# EasyEDA Pro project PCB_主控有光耦2.0.epro

# Board PCB_PCB_主控有光耦2.0_2025-02-19_1
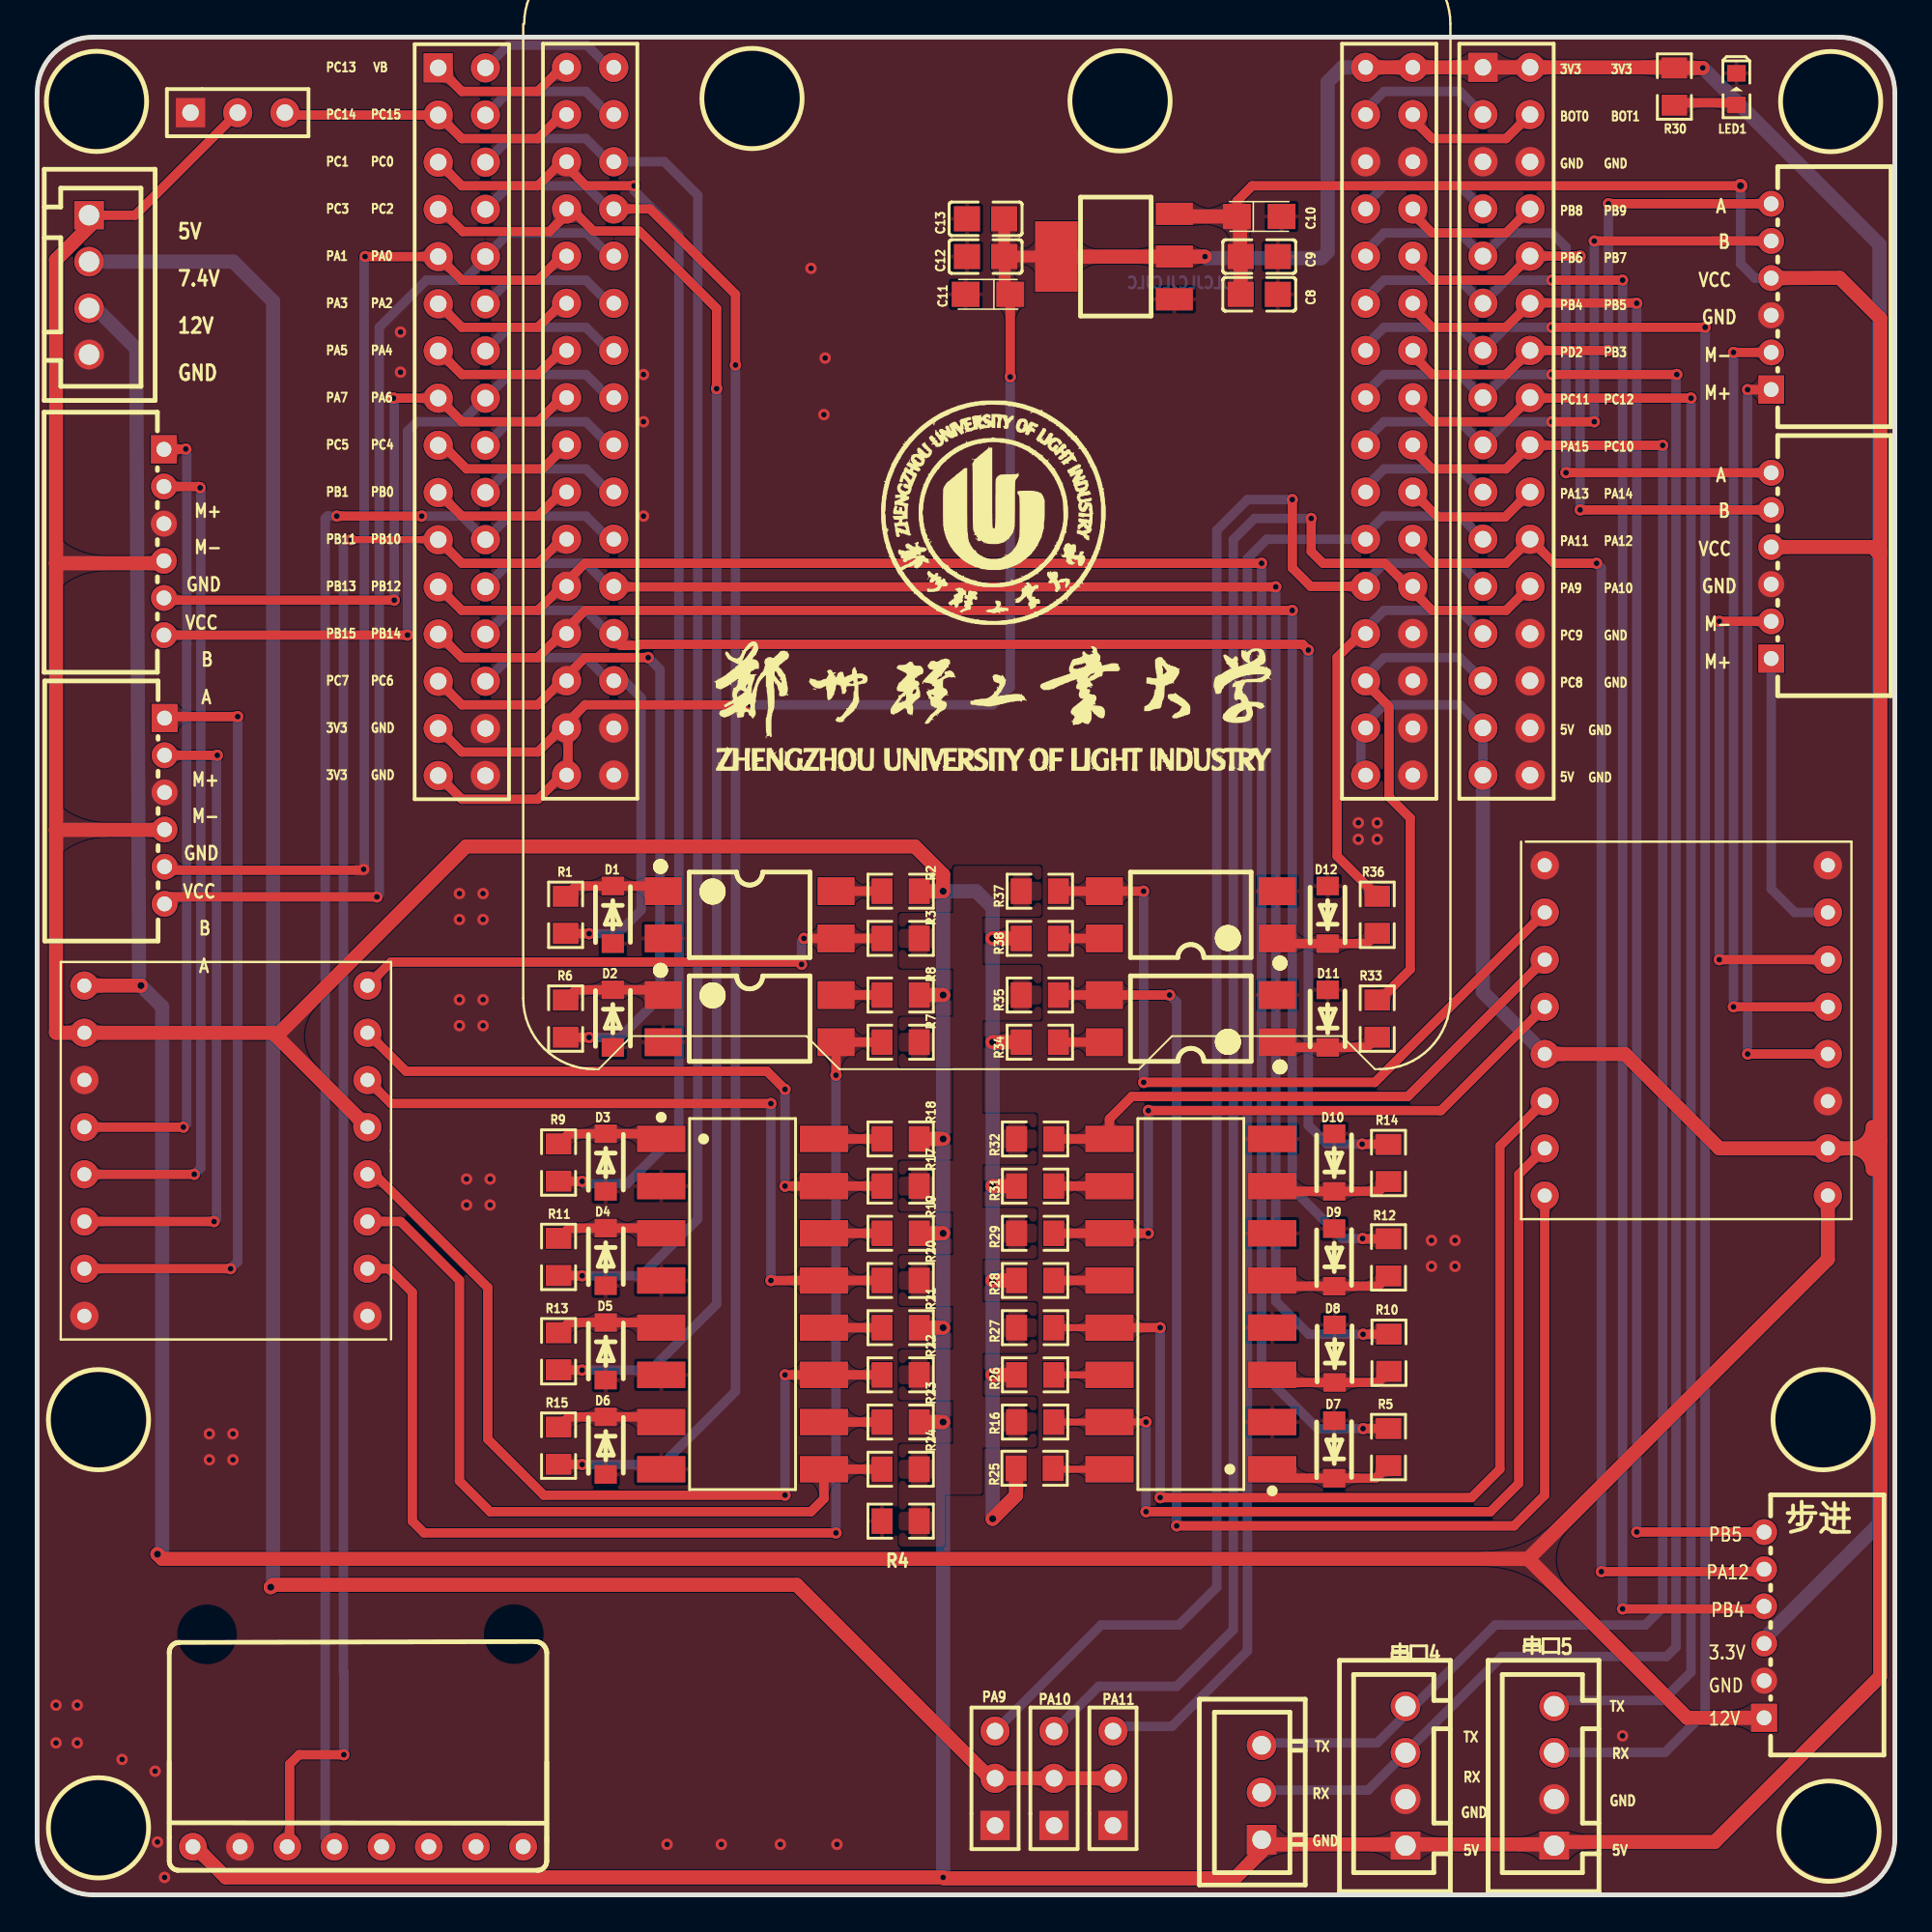
[diagram p0: board, top side]
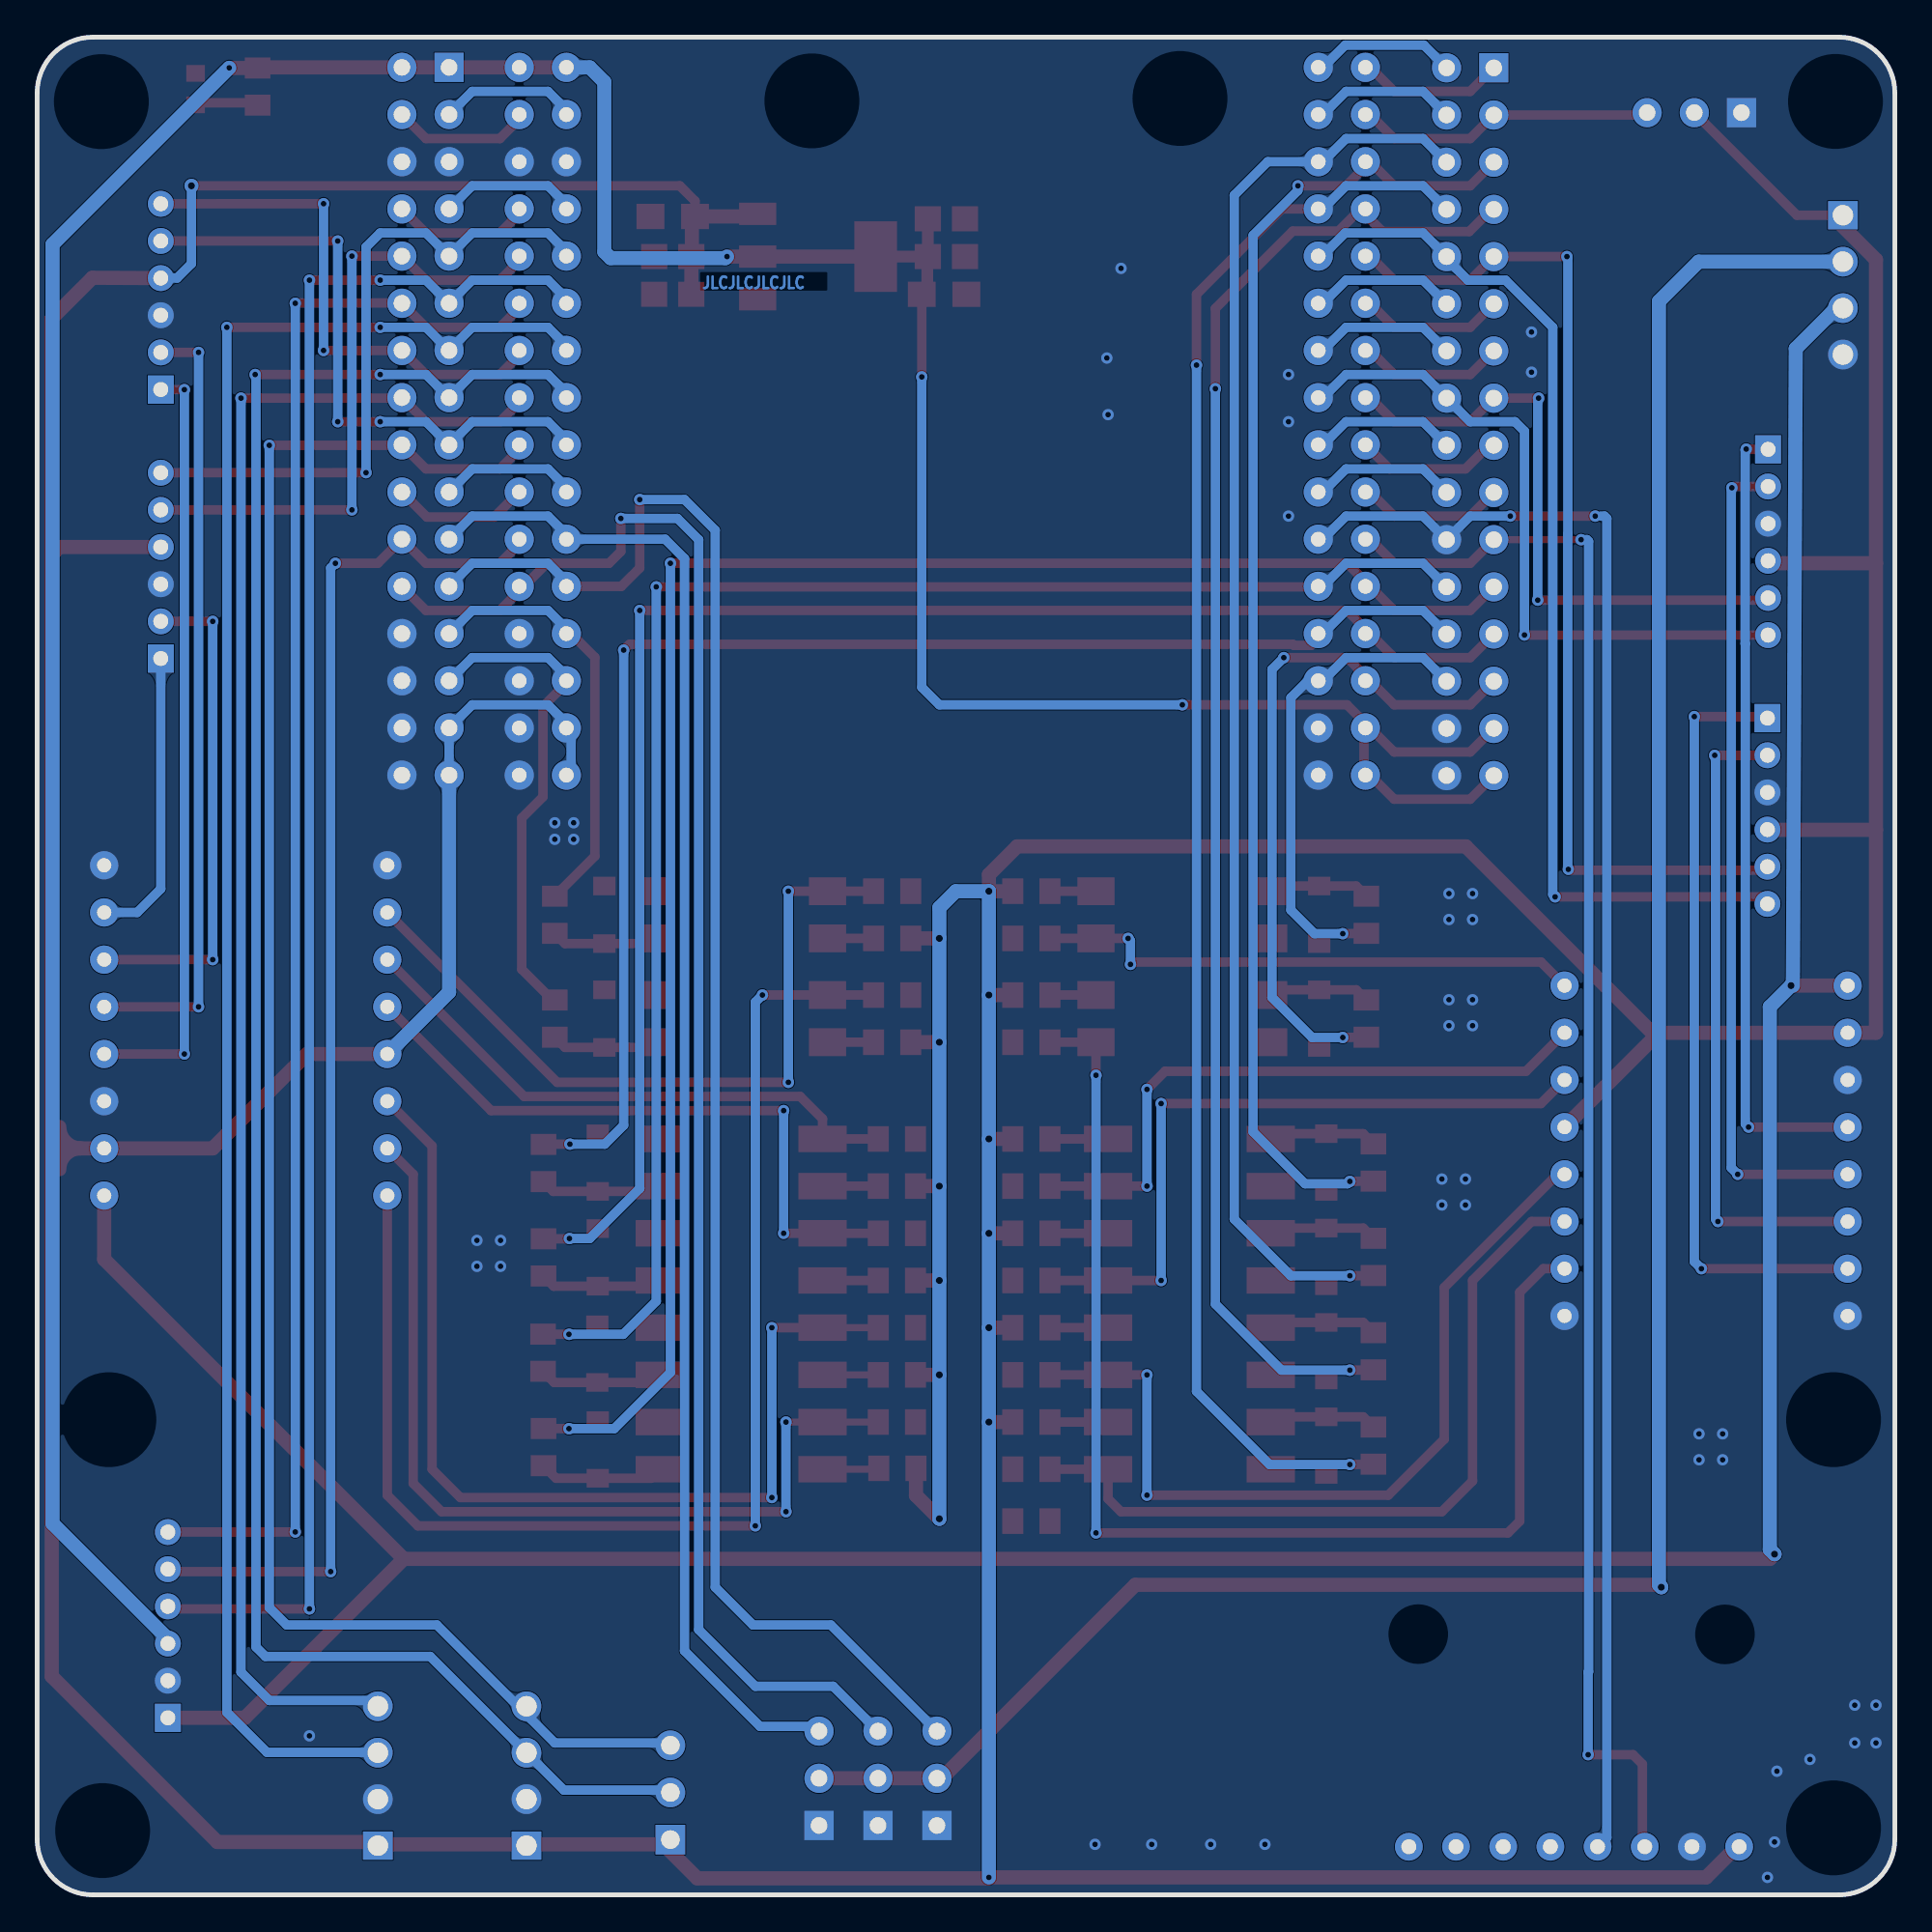
[diagram p1: board, bottom side, seen from below]

Outline 100 x 100 mm; copper layers: Top Layer, Bottom Layer. Coordinates in mm from the lower left corner of the outline.
Outline path: 0,97 arc(0.88,99.12) 3,100 97,100 arc(99.12,99.12) 100,97 100,3 arc(99.12,0.88) 97,0 3,0 arc(0.88,0.88) 0,3 0,97
Stack: Top Layer 0.035mm / Dielectric1 1.51mm FR4 er 4.5 / Bottom Layer 0.035mm

## Design rules (mm)
spacing Default (default): track to track 0.152, other pairs 0 to 0.152
track width Default (default): min 0.254, default 0.254, max 25.4
differential pair differentialPair (default): width min 0.127, default 0.254, max 2.54; gap min 0.152, default 0.152
via Default (default): diameter min 0.61, default 0.61, max 100.025; hole min 0.305, default 0.305, max 59.995
pour e923 uses gge64914

## Placement (name value [footprint] x y rotation side)
C8  0.1u  [C0805]  65.79 86.16 180 top
C9  10u  [C0805]  65.79 88.19 180 top
C10  0.1u  [CASE-A_3216]  65.79 90.35 0 top
C11  0.1u  [CASE-A_3216]  51.18 86.16 180 top
C12  10u  [C0805]  51.05 88.19 0 top
C13  0.1u  [C0805]  51.05 90.22 0 top
CN1  KH-PH-6P-W  [CONN-TH_6P-P2.00_KINGHELM_KH-PH-6P-W]  6.82 72.81 270 top
CN2  KH-PH-6P-W  [CONN-TH_6P-P2.00_KINGHELM_KH-PH-6P-W]  6.86 58.34 270 top
CN3  KH-PH-6P-W  [CONN-TH_6P-P2.00_KINGHELM_KH-PH-6P-W]  93.34 86.03 90 top
CN4  KH-PH-6P-W  [CONN-TH_6P-P2.00_KINGHELM_KH-PH-6P-W]  93.34 71.55 90 top
CN7  KH-PH-6P-W  [CONN-TH_6P-P2.00_KINGHELM_KH-PH-6P-W]  92.96 14.53 90 top
CN10  -  [CONN-TH_4P-P2.50_4PIN]  81.66 6.4 90 top
CN10#2  -  [CONN-TH_4P-P2.50_4PIN]  2.79 86.67 270 top
CN11  ZX-XH2.54-4PZZ  [CONN-TH_4P-P2.50_4PIN]  73.66 6.4 90 top
CN12  ZX-XH2.54-3PZZ  [CONN-TH_3P-P2.54_2501S-3P]  65.91 5.51 90 top
D1  1N4001W  [SOD-123F_L2.8-W1.8-LS3.7-RD]  30.99 52.76 270 top
D2  1N4001W  [SOD-123F_L2.8-W1.8-LS3.7-RD]  30.99 47.17 270 top
D3  1N4001W  [SOD-123F_L2.8-W1.8-LS3.7-RD]  30.61 39.42 270 top
D4  1N4001W  [SOD-123F_L2.8-W1.8-LS3.7-RD]  30.61 34.34 270 top
D5  1N4001W  [SOD-123F_L2.8-W1.8-LS3.7-RD]  30.61 29.26 270 top
D6  1N4001W  [SOD-123F_L2.8-W1.8-LS3.7-RD]  30.61 24.18 270 top
D7  1N4001W  [SOD-123F_L2.8-W1.8-LS3.7-RD]  69.82 23.98 90 top
D8  1N4001W  [SOD-123F_L2.8-W1.8-LS3.7-RD]  69.85 29.13 90 top
D9  1N4001W  [SOD-123F_L2.8-W1.8-LS3.7-RD]  69.82 34.31 90 top
D10  1N4001W  [SOD-123F_L2.8-W1.8-LS3.7-RD]  69.82 39.42 90 top
D11  1N4001W  [SOD-123F_L2.8-W1.8-LS3.7-RD]  69.47 47.17 90 top
D12  1N4001W  [SOD-123F_L2.8-W1.8-LS3.7-RD]  69.47 52.76 90 top
H1  HDR-F-2.54_2x16  [HDR-F-2.54_2X16]  22.86 79.3 270 top
H2  HDR-F-2.54_2x16  [HDR-F-2.54_2X16]  79.1 79.32 270 top
J2  HDR-M-2.54_1x3  [HDR-M-2.54_1X3]  51.56 6.27 90 top
J3  HDR-M-2.54_1x3  [HDR-M-2.54_1X3]  54.74 6.27 90 top
J4  -  [HDR-M-2.54_1X3]  10.8 95.94 0 top
J4#2  -  [HDR-M-2.54_1X3]  57.91 6.27 90 top
LED1  LED-0603_R  [LED0603_RED]  91.47 97.2 90 top
P1  -  [MPU6050模块]  17.53 5.89 270 top
R1  215Ω  [R0805]  28.45 52.76 90 top
R2  2k  [R0805]  46.48 54.03 0 top
R3  10k  [R0805]  46.48 51.49 0 top
R4  0  [R0805]  46.48 20.12 0 top
R5  215Ω  [R0805]  72.74 24.1 270 top
R6  215Ω  [R0805]  28.45 47.17 90 top
R7  10k  [R0805]  46.48 45.9 0 top
R8  2k  [R0805]  46.48 48.44 0 top
R9  215Ω  [R0805]  28.07 39.42 90 top
R10  215Ω  [R0805]  72.77 29.18 270 top
R11  215Ω  [R0805]  28.07 34.34 90 top
R12  215Ω  [R0805]  72.74 34.31 270 top
R13  215Ω  [R0805]  28.07 29.26 90 top
R14  215Ω  [R0805]  72.74 39.39 270 top
R15  215Ω  [R0805]  28.07 24.18 90 top
R16  10k  [R0805]  53.72 25.45 180 top
R17  10k  [R0805]  46.48 38.15 0 top
R18  2k  [R0805]  46.48 40.69 0 top
R19  2k  [R0805]  46.48 35.61 0 top
R20  10k  [R0805]  46.48 33.07 0 top
R21  2k  [R0805]  46.48 30.53 0 top
R22  10k  [R0805]  46.48 27.99 0 top
R23  2k  [R0805]  46.48 25.45 0 top
R24  10k  [R0805]  46.48 22.91 0 top
R25  2k  [R0805]  53.69 22.96 180 top
R26  2k  [R0805]  53.72 27.99 180 top
R27  10k  [R0805]  53.72 30.53 180 top
R28  2k  [R0805]  53.72 33.07 180 top
R29  10k  [R0805]  53.72 35.61 180 top
R30  1k  [R0805]  88.13 97.34 90 top
R31  2k  [R0805]  53.72 38.15 180 top
R32  10k  [R0805]  53.72 40.69 180 top
R33  215Ω  [R0805]  72.14 47.17 270 top
R34  2k  [R0805]  53.97 45.9 180 top
R35  10k  [R0805]  53.97 48.44 180 top
R36  215Ω  [R0805]  72.14 52.76 270 top
R37  10k  [R0805]  53.97 54.03 180 top
R38  2k  [R0805]  53.97 51.49 180 top
U1  NO  [STM32F103RCT6最小系统]  51.56 79.43 0 top
U2  -  [TB6612电机驱动]  10.16 40.06 0 top
U3  -  [TB6612电机驱动]  88.77 46.53 180 top
U4  AMS1117-3.3  [SOT-223]  58.04 88.19 180 top
U5  TLP521-1XSM  [SMD-4_L4.6-W6.5-P2.54-LS10.2-BL]  38.35 47.17 270 top
U7  TLP521-1XSM  [SMD-4_L4.6-W6.5-P2.54-LS10.2-BL]  38.35 52.76 270 top
U8  TLP521-4XSM  [SMD-16_L20.0-W6.5-P2.54-LS10.2-BL]  37.97 31.8 270 top
U9  TLP521-4XSM  [SMD-16_L20.0-W6.5-P2.54-LS10.2-BL]  62.1 31.8 90 top
U10  TLP521-1XSM  [SMD-4_L4.6-W6.5-P2.54-LS10.2-BL]  62.1 47.17 90 top
U11  TLP521-1XSM  [SMD-4_L4.6-W6.5-P2.54-LS10.2-BL]  62.1 52.76 90 top

## Footprints (pads in the part's own frame, mm; a bottom-side part is the same pattern mirrored in y, then rotated)
C0805
  rect 1.41x1.35 smd: 1(-1,0) 2(1,0)
CASE-A_3216
  rect 1.5x1.359 smd: 1(-1.2,0) 2(1.2,0)
CONN-TH_3P-P2.54_2501S-3P
  rect 1.6x1.6 hole 1: 1(-2.54,0)
  round 1.6 hole 1: 2(0,0) 3(2.54,0)
CONN-TH_4P-P2.50_4PIN
  rect 1.524x1.6 hole 1.1: 1(-3.75,0)
  round 1.6 hole 1.1: 2(-1.25,0) 3(1.25,0) 4(3.75,0)
CONN-TH_6P-P2.00_KINGHELM_KH-PH-6P-W
  rect 1.524x1.4 hole 0.8: 1(-5,0)
  round 1.4 hole 0.8: 2(-3,0) 3(-1,0) 4(1,0) 5(3,0) 6(5,0)
HDR-F-2.54_2X16
  rect 1.575x1.575 hole 0.889: 1(-19.05,-1.27)
  round 1.575 hole 0.889: 2(-19.05,1.27) 3(-16.51,-1.27) 4(-16.51,1.27) 5(-13.97,-1.27) 6(-13.97,1.27) 7(-11.43,-1.27) 8(-11.43,1.27) 9(-8.89,-1.27) 10(-8.89,1.27) 11(-6.35,-1.27) 12(-6.35,1.27) 13(-3.81,-1.27) 14(-3.81,1.27) 15(-1.27,-1.27) 16(-1.27,1.27) 17(1.27,-1.27) 18(1.27,1.27) 19(3.81,-1.27) 20(3.81,1.27) 21(6.35,-1.27) 22(6.35,1.27) 23(8.89,-1.27) 24(8.89,1.27) 25(11.43,-1.27) 26(11.43,1.27) 27(13.97,-1.27) 28(13.97,1.27) 29(16.51,-1.27) 30(16.51,1.27) 31(19.05,-1.27) 32(19.05,1.27)
HDR-M-2.54_1X3
  rect 1.575x1.575 hole 0.889: 1(-2.54,0)
  round 1.575 hole 0.889: 2(0,0) 3(2.54,0)
LED0603_RED
  rect 0.9x1 smd: 1(-0.85,0) 2(0.85,0)
MPU6050模块
  round 1.5 hole 0.8: 1(3.302,-9.144) 2(3.302,-6.604) 3(3.302,-4.064) 4(3.302,-1.524) 5(3.302,1.016) 6(3.302,3.556) 7(3.302,6.096) 8(3.302,8.636)
R0805
  rect 1.133x1.377 smd: 1(-1,0) 2(1,0)
SMD-4_L4.6-W6.5-P2.54-LS10.2-BL
  rect 1.5x2 smd: 1(-1.27,-4.65) 2(1.27,-4.65) 3(1.27,4.65) 4(-1.27,4.65)
SMD-16_L20.0-W6.5-P2.54-LS10.2-BL
  rect 1.423x2.6 smd: 1(-8.89,-4.38) 2(-6.35,-4.38) 3(-3.81,-4.38) 4(-1.27,-4.38) 5(1.27,-4.38) 6(3.81,-4.38) 7(6.35,-4.38) 8(8.89,-4.38) 9(8.89,4.38) 10(6.35,4.38) 11(3.81,4.38) 12(1.27,4.38) 13(-1.27,4.38) 14(-3.81,4.38) 15(-6.35,4.38) 16(-8.89,4.38)
SOD-123F_L2.8-W1.8-LS3.7-RD
  rect 1x1.2 smd: 1(-1.55,0) 2(1.55,0)
SOT-223
  rect 2x1.2 smd: 1(-3.175,2.3) 2(-3.175,0) 3(-3.175,-2.3)
  rect 2.3x3.8 smd: 4(3.175,0)
STM32F103RCT6最小系统
  round 1.575 hole 0.787x0.792: 3V3_1(-23.063,-16.611) 3V3_2(-23.063,-19.151) 3V3_3(19.948,18.948) 3V3_4(22.488,18.948) 5V_1(19.948,-16.613) 5V_2(19.948,-19.152) BOOT0(19.948,16.407) BOOT1(22.488,16.407) GND_1(-20.523,-16.611) GND_2(-20.523,-19.151) GND_3(19.948,13.867) GND_4(22.488,13.867) GND_5(22.488,-11.533) GND_6(22.488,-14.072) GND_7(22.488,-16.613) GND_8(22.488,-19.152) PA0(-20.523,8.789) PA1(-23.063,8.789) PA2(-20.523,6.248) PA3(-23.063,6.248) PA4(-20.523,3.708) PA5(-23.063,3.708) PA6(-20.523,1.169) PA7(-23.063,1.169) PA9(19.948,-8.992) PA10(22.488,-8.992) PA11(19.948,-6.452) PA12(22.488,-6.452) PA13(19.948,-3.913) PA14(22.488,-3.913) PA15(19.948,-1.373) PB0(-20.523,-3.912) PB1(-23.063,-3.912) PB3(22.488,3.708) PB4(19.948,6.247) PB5(22.488,6.247) PB6(19.948,8.787) PB7(22.488,8.787) PB8(19.948,11.328) PB9(22.488,11.328) PB10(-20.523,-6.452) PB11(-23.063,-6.452) PB12(-20.523,-8.992) PB13(-23.063,-8.992) PB14(-20.523,-11.531) PB15(-23.063,-11.531) PC0(-20.523,13.868) PC1(-23.063,13.868) PC2(-20.523,11.329) PC3(-23.063,11.329) PC4(-20.523,-1.371) PC5(-23.063,-1.371) PC6(-20.523,-14.072) PC7(-23.063,-14.072) PC8(19.948,-14.072) PC9(19.948,-11.533) PC10(22.488,-1.373) PC11(19.948,1.167) PC12(22.488,1.167) PC13(-23.063,18.948) PC14(-23.063,16.409) PC15(-20.523,16.409) PD2(19.948,3.708) VB(-20.523,18.948)
TB6612电机驱动
  round 1.524 hole 0.762: 1(7.62,8.89) 2(7.62,6.35) 3(7.62,3.81) 4(7.62,1.27) 5(7.62,-1.27) 6(7.62,-3.81) 7(7.62,-6.35) 8(7.62,-8.89) 9(-7.62,-8.89) 10(-7.62,-6.35) 11(-7.62,-3.81) 12(-7.62,-1.27) 13(-7.62,1.27) 14(-7.62,3.81) 15(-7.62,6.35) 16(-7.62,8.89)

## Nets
3.3V: C11.1 C12.2 C13.2 CN7.3 H1.29 H1.31 H2.1 H2.2 R30.2 U1.3V3_1 U1.3V3_2 U1.3V3_3 U1.3V3_4 U4.2 U4.4
5V: C8.2 C9.2 C10.1 CN1.4 CN2.4 CN3.4 CN4.4 CN10.1 CN10#2.1 CN11.1 CN12.1 H2.29 H2.31 J4.2 P1.1 R2.2 R8.2 R18.2 R19.2 R21.2 R23.2 R25.2 R26.2 R28.2 R31.2 R34.2 R38.2 U1.5V_1 U1.5V_2 U2.4 U2.15 U3.4 U3.15 U4.3
7.4V: CN10#2.2 J2.2 J3.2 J4#2.2
12V: CN7.1 CN10#2.3 U2.16 U3.16
GND: C8.1 C9.1 C10.2 C11.2 C12.1 C13.1 CN1.3 CN2.3 CN3.3 CN4.3 CN7.2 CN10.2 CN10#2.4 CN11.2 D1.2 D2.2 D3.2 D4.2 D5.2 D6.2 D7.2 D8.2 D9.2 D10.2 D11.2 D12.2 H1.30 H1.32 H2.5 H2.6 H2.26 H2.28 H2.30 H2.32 J2.1 J3.1 J4.1 J4#2.1 LED1.2 P1.2 R4.1 U1.GND_1 U1.GND_2 U1.GND_3 U1.GND_4 U1.GND_5 U1.GND_6 U1.GND_7 U1.GND_8 U2.8 U2.9 U2.14 U3.8 U3.9 U3.14 U4.1 U5.2 U7.2 U8.2 U8.4 U8.6 U8.8 U9.2 U9.4 U9.6 U9.8 U10.2 U11.2
BOOT0: H2.3 U1.BOOT0
BOOT1: H2.4 U1.BOOT1
D1_1: D1.1 R1.2 U7.1
D3_1: D3.1 R9.2 U8.1
D4_1: D4.1 R11.2 U8.3
D5_1: D5.1 R13.2 U8.5
D6_1: D6.1 R15.2 U8.7
GGND: R3.2 R4.2 R7.2 R16.2 R17.2 R20.2 R22.2 R24.2 R27.2 R29.2 R32.2 R35.2 R37.2
LA1: CN1.6 H1.16 U1.PA6
LA2: CN2.6 H1.10 U1.PA0
LAIN1: H1.6 R11.1 U1.PC0
LAIN2: H1.5 R9.1 U1.PC1
LAO1: CN1.1 U2.13
LAO2: CN1.2 U2.12
LB1: CN1.5 H1.15 U1.PA7
LB2: CN2.5 H1.9 U1.PA1
LBIN1: H1.7 R13.1 U1.PC3
LBIN2: H1.8 R15.1 U1.PC2
LBO1: CN2.1 U2.10
LBO2: CN2.2 U2.11
LED17_1: LED1.1 R30.1
LINA1: R20.1 U2.3 U8.13
LINA2: R17.1 U2.2 U8.15
LINB1: R22.1 U2.5 U8.11
LINB2: R24.1 U2.6 U8.9
LPA: R3.1 U2.1 U7.3
LPB: R7.1 U2.7 U5.3
LPWMA: H1.28 R1.1 U1.PC6
LPWMB: H1.27 R6.1 U1.PC7
PA2: H1.12 U1.PA2
PA3: H1.11 U1.PA3
PA4: H1.14 U1.PA4
PA5: H1.13 U1.PA5
PA9: H2.23 J2.3 U1.PA9
PA10: H2.24 J3.3 U1.PA10
PA11: H2.21 J4#2.3 U1.PA11
PA12: CN7.5 H2.22 U1.PA12
PB0: H1.20 U1.PB0
PB1: H1.19 U1.PB1
PB4: CN7.4 H2.11 U1.PB4
PB5: CN7.6 H2.12 U1.PB5
PB8: H2.7 U1.PB8
PB9: H2.8 U1.PB9
PC4: H1.18 U1.PC4
PC5: H1.17 U1.PC5
PC10: CN11.4 CN12.3 H2.18 U1.PC10
PC11: CN11.3 CN12.2 H2.15 U1.PC11
PC12: CN10.4 H2.16 U1.PC12
PC13: H1.1 U1.PC13
PC14: H1.3 J4.3 U1.PC14
PC15: H1.4 U1.PC15
PD2: CN10.3 H2.13 U1.PD2
R2_1: R2.1 U7.4
R6_2: D2.1 R6.2 U5.1
R8_1: R8.1 U5.4
R18_1: R18.1 U8.16
R19_1: R19.1 U8.14
R21_1: R21.1 U8.12
R23_1: R23.1 U8.10
RA1: CN3.6 H2.14 U1.PB3
RA2: CN4.6 H2.9 U1.PB6
RAIN1: H1.24 R10.1 U1.PB12
RAIN2: H1.23 R5.1 U1.PB13
RAO1: CN3.1 U3.13
RAO2: CN3.2 U3.12
RB1: CN3.5 H2.17 U1.PA15
RB2: CN4.5 H2.10 U1.PB7
RBIN1: H1.25 R12.1 U1.PB15
RBIN2: H1.26 R14.1 U1.PB14
RBO1: CN4.1 U3.10
RBO2: CN4.2 U3.11
RINA1: R27.1 U3.3 U9.13
RINA2: R16.1 U3.2 U9.15
RINB1: R29.1 U3.5 U9.11
RINB2: R32.1 U3.6 U9.9
RPA: R35.1 U3.1 U10.3
RPB: R37.1 U3.7 U11.3
RPWMA: H2.27 R33.1 U1.PC8
RPWMB: H2.25 R36.1 U1.PC9
SCL: H1.21 P1.3 U1.PB11
SDA: H1.22 P1.4 U1.PB10
SWCLK: H2.20 U1.PA14
SWDIO: H2.19 U1.PA13
U9_1: D7.1 R5.2 U9.1
U9_3: D8.1 R10.2 U9.3
U9_5: D9.1 R12.2 U9.5
U9_7: D10.1 R14.2 U9.7
U9_10: R31.1 U9.10
U9_12: R28.1 U9.12
U9_14: R26.1 U9.14
U9_16: R25.1 U9.16
U10_1: D11.1 R33.2 U10.1
U10_4: R34.1 U10.4
U11_1: D12.1 R36.2 U11.1
U11_4: R38.1 U11.4
VB: H1.2 U1.VB

Pads without a net: P1 5 6 7 8

## Via types
v1: diameter 0.762, hole 0.381, Top Layer to Bottom Layer, 16 vias
v2: diameter 0.61, hole 0.305, Top Layer to Bottom Layer, 48 vias
v3: diameter 0.62, hole 0.31, Top Layer to Bottom Layer, 87 vias

## Routing (per net, layer and track width the routed paths; a pad name or vN(x,y) marks a point on that pad's centre or on a via; arc(x,y) is an arc through that point)
3.3V: length 207.6
  Top Layer w0.508: v3(38.35,64.06) 29.49,64.06 28.25,62.81 ; 28.25,62.81 28.57,62.48 28.57,60.6 26.95,58.98 22.86,58.98 21.59,60.25 ; 28.25,62.81 26.95,61.52 22.86,61.52 H1.29 ; C11.1 v3(52.38,81.71)
  Top Layer w0.635: 52.09,88.19 U4.4 ; 52.09,88.19 52.06,88.22 52.06,90.22 ; 52.09,88.19 52.09,86.45 C11.1
  Top Layer w0.762: v3(62.87,88.19) U4.2 U4.4 ; v2(89.66,98.35) 89.65,98.34 R30.2 88.1,98.37 H2.2 H2.1 73.8,98.37 71.26,98.37
  Bottom Layer w0.508: v3(38.35,64.06) 51.44,64.06 52.38,65 v3(52.38,81.71)
  Bottom Layer w0.762: 71.64,98.37 70.26,98.37 69.47,97.59 69.47,88.44 69.13,88.1 62.95,88.1 v3(62.87,88.19) ; v2(89.66,98.35) 99.17,88.84 99.17,19.99 92.96,13.78 CN7.3
5V: length 508.2
  Top Layer w0.508: C10.1 64.59,91.18 65.41,92 v1(91.69,92) ; CN10#2.1 5.27,90.42 J4.2
  Top Layer w0.762: 64.78,86.16 64.78,88.16 64.75,88.19 64.75,90.18 ; 47.48,54.03 v1(48.77,54.03) 48.77,54.92 47.24,56.44 23.09,56.44 12.88,46.23 ; 99.22,40.59 99.22,72.14 99.09,72.27 ; 99.22,40.59 99.22,11.76 90.3,2.84 81.85,2.84 81.73,2.72 ; 99.22,40.59 98.81,40.18 U3.15 90.55,40.18 85.47,45.26 U3.4 ; 66.29,2.72 64.47,0.89 48.82,0.89 v2(48.77,0.94) 10.16,0.94 8.51,2.59 ; 66.29,2.72 73.73,2.72 ; 66.29,2.72 65.91,3.1 ; 47.48,25.45 v1(48.77,25.45) ; 52.97,45.9 v1(51.44,45.9) ; 99.09,72.27 98.81,72.55 CN4.4 ; 99.09,72.27 99.22,72.4 99.22,84.86 97.03,87.05 93.35,87.03 ; 1.02,71.68 1.02,88.02 3.1,90.11 CN10#2.1 ; 1.02,71.68 1.02,57.33 ; 1.02,71.68 6.77,71.68 6.82,71.73 ; 1.02,57.33 6.84,57.33 CN2.4 ; 1.02,57.33 1.02,46.41 U2.15 12.7,46.41 12.88,46.23 ; U4.3 61.36,90.35 C10.1 ; 52.69,22.96 52.69,21.5 v1(51.44,20.24) ; 73.73,2.72 CN11.1 ; 73.73,2.72 81.73,2.72 ; 12.88,46.23 U2.4 ; 52.97,51.49 v1(51.44,51.49) ; 47.48,35.61 v1(48.77,35.61) ; 81.73,2.72 CN10.1 ; R26.2 v1(51.44,27.99) ; 47.48,40.69 v1(48.77,40.69) ; 47.48,30.53 v1(48.77,30.53) ; R31.2 v1(51.44,38.15) ; R28.2 v1(51.44,33.07) ; 47.48,48.44 v1(48.77,48.44)
  Bottom Layer w0.508: H2.31 H2.29 76.58,64.06 72.5,64.06 71.26,62.81 71.26,60.27 ; 93.34,87.03 92.47,87.03 91.69,87.81 v1(91.69,92)
  Bottom Layer w0.762: H2.31 77.83,48.59 U3.4 ; v1(51.44,20.24) v1(51.44,27.99) v1(51.44,33.07) v1(51.44,38.15) v1(51.44,45.9) v1(51.44,51.49) 51.44,53.14 50.55,54.03 v1(48.77,54.03) v1(48.77,48.44) v1(48.77,40.69) v1(48.77,35.61) v1(48.77,30.53) v1(48.77,25.45) v2(48.77,0.94)
7.4V: length 129.8
  Top Layer w0.762: v1(12.57,16.56) 12.7,16.69 40.89,16.69 51.17,6.4 51.44,6.4 J2.2 J3.2 J4#2.2
  Bottom Layer w0.762: v1(12.57,16.56) 12.7,16.69 12.7,85.78 10.56,87.92 CN10#2.2
12V: length 188.3
  Top Layer w0.762: 80.26,18.09 88.82,9.53 CN7.1 ; 80.26,18.09 96.39,34.21 U3.16 ; 80.26,18.09 6.73,18.09 v1(6.48,18.34) ; U2.16 v1(5.59,48.95)
  Bottom Layer w0.762: v1(6.48,18.34) 6.73,18.59 6.73,47.8 v1(5.59,48.95) ; CN10#2.3 3.16,85.42 5.33,83.24 5.49,48.95
GND:
  vias: v2(1.02,10.21) v2(1.02,8.18) v2(2.16,10.21) v2(2.16,8.18) v2(4.57,7.29) v2(6.35,6.66) v2(6.48,2.84) v2(6.86,0.94) v2(9.27,24.82) v2(9.27,23.42) v2(10.54,24.82) v2(10.54,23.42) v2(19.56,84.12) v2(19.56,81.97) v2(22.73,53.9) v2(22.73,52.5) v2(22.73,48.18) v2(22.73,46.79) v2(23.11,38.53) v2(23.11,37.14) v2(24,53.9) v2(24,52.5) v2(24,48.18) v2(24,46.79) v2(24.38,38.53) v2(24.38,37.14) v2(32.64,81.84) v2(32.64,79.3) v2(32.64,74.22) v2(33.91,2.72) v2(36.83,2.72) v2(40,2.72) v2(41.66,87.55) v2(42.42,82.73) v2(42.35,79.68) v2(43.05,2.72) v2(71.12,57.71) v2(71.12,56.82) v2(72.14,57.71) v2(72.14,56.82) v2(75.06,35.23) v2(75.06,33.83) v2(76.33,35.23) v2(76.33,33.83) v2(85.34,8.56)
BOOT0: length 7.6
  Bottom Layer w0.508: 71.26,95.83 72.5,97.08 76.58,97.08 H2.3
BOOT1: length 7.6
  Top Layer w0.508: H2.4 79.07,94.54 75.09,94.54 73.8,95.83
D1_1: length 5.6
  Top Layer w0.508: R1.2 29,54.31 D1.1 33.42,54.31 U7.1
D3_1: length 5.9
  Top Layer w0.508: 28.07,40.42 28.62,40.97 33.31,40.97 33.59,40.69
D4_1: length 5.9
  Top Layer w0.508: 28.07,35.34 28.62,35.89 D4.1 33.31,35.89 33.59,35.61
D5_1: length 5.9
  Top Layer w0.508: 33.59,30.53 33.31,30.81 28.62,30.81 28.07,30.26
D6_1: length 5.9
  Top Layer w0.508: U8.7 33.31,25.73 28.62,25.73 28.07,25.18
LA1: length 36.7
  Top Layer w0.508: CN1.6 19.93,67.81 v3(19.94,67.82)
  Bottom Layer w0.508: 30.78,80.59 29.54,81.84 25.4,81.84 H1.16 22.86,79.3 20.45,79.3 19.94,78.79 v3(19.94,67.82)
LA2: length 57.4
  Top Layer w0.508: CN2.6 7.23,53.72 v3(18.29,53.72)
  Bottom Layer w0.508: v3(18.29,53.72) 18.42,53.85 18.42,84.38 20.95,86.92 22.99,86.92 24.13,88.06 H1.10 25.4,89.46 29.59,89.46 30.78,88.27 30.78,88.21
LAIN1: length 77.1
  Top Layer w0.508: v3(29.34,33.33) R11.1
  Bottom Layer w0.508: H1.6 25.4,94.54 29.54,94.54 30.78,93.29 33.76,93.29 35.56,91.49 35.56,36.37 32.51,33.33 v3(29.34,33.33)
LAIN2: length 71.8
  Top Layer w0.508: v3(32.13,92) 29.54,92 28.25,93.29 26.95,92 22.86,92 H1.5 ; v3(29.34,38.41) R9.1
  Bottom Layer w0.508: v3(32.13,92) 32.13,91.75 34.54,89.33 34.54,41.07 31.75,38.28 29.46,38.28 v3(29.34,38.41)
LAO1: length 43.1
  Top Layer w0.508: CN1.1 7.71,77.81 7.72,77.83 v3(8,77.83) ; U2.13 v3(7.87,41.33)
  Bottom Layer w0.508: v3(8,77.83) 8.06,77.77 8.06,67.35 8.05,67.34 8.05,41.5 v3(7.87,41.33)
LAO2: length 45
  Top Layer w0.508: CN1.2 8.7,75.81 v3(8.77,75.74) ; U2.12 v3(8.46,38.79)
  Bottom Layer w0.508: v3(8.46,38.79) 8.81,39.14 8.81,75.71 v3(8.77,75.74)
LB1: length 33.5
  Top Layer w0.508: v3(19.22,69.69) 6.94,69.69 CN1.5 ; v3(19.18,80.57) H1.15 22.86,79.3 26.95,79.3 28.25,80.59
  Bottom Layer w0.508: v3(19.18,80.57) 19.22,80.52 v3(19.22,69.69)
LB2: length 55.5
  Top Layer w0.508: v3(17.65,88.19) H1.9 22.86,86.92 26.95,86.92 28.25,88.21 ; CN2.5 7.05,55.15 17.53,55.15 v2(17.58,55.2)
  Bottom Layer w0.508: v2(17.58,55.2) 17.61,55.23 17.61,73.25 17.6,73.25 17.6,88.14 v3(17.65,88.19)
LBIN1: length 81.8
  Top Layer w0.508: v3(29.34,28.25) R13.1 ; 21.59,90.73 21.72,90.73 22.91,89.53 27.58,89.53 28.75,90.71 28.75,90.75 29.95,89.56 32.41,89.56 36.58,85.39 v3(36.58,81.08)
  Bottom Layer w0.508: v3(29.34,28.25) 33.02,28.25 36.58,31.8 v3(36.58,81.08)
LBIN2: length 86.6
  Top Layer w0.508: v3(29.34,23.16) R15.1 ; v3(37.59,82.35) 37.59,86.16 32.99,90.75 30.78,90.75
  Bottom Layer w0.508: 30.78,90.75 29.54,92 25.4,92 24.13,90.73 ; v3(29.34,23.16) 33.66,23.16 37.59,27.1 v3(37.59,82.35)
LBO1: length 41.7
  Top Layer w0.508: CN2.1 6.94,63.42 v3(10.8,63.42) ; U2.10 v3(10.41,33.71)
  Bottom Layer w0.508: v3(10.8,63.42) 10.8,34.09 v3(10.41,33.71)
LBO2: length 35
  Top Layer w0.508: v3(9.7,61.34) 6.86,61.34 CN2.2 ; U2.11 v3(9.53,36.25)
  Bottom Layer w0.508: v3(9.7,61.34) 9.65,61.3 9.65,36.37 v3(9.53,36.25)
LED17_1: length 3.4
  Top Layer w0.508: LED1.1 91.42,96.41 91.42,96.41 91.36,96.47 88.13,96.47
LINA1: length 37.8
  Top Layer w0.508: v3(39.5,33.07) 45.48,33.07 ; v3(39.5,42.6) 19.05,42.6 U2.3
  Bottom Layer w0.508: v3(39.5,33.07) v3(39.5,42.6)
LINA2: length 34.2
  Top Layer w0.508: 45.48,38.15 v3(40.26,38.15) ; v3(40.26,43.36) 39.28,44.33 19.85,44.33 U2.2
  Bottom Layer w0.508: v3(40.26,38.15) v3(40.26,43.36)
LINB1: length 46.1
  Top Layer w0.508: 45.48,27.99 U8.11 v3(40.26,27.99) ; U2.5 18.16,38.79 24.26,32.69 24.26,24.53 27.27,21.51 v3(40.26,21.51)
  Bottom Layer w0.508: v3(40.26,21.51) v3(40.26,27.99)
LINB2: length 42.4
  Top Layer w0.508: 45.48,22.91 U8.9 42.35,21.32 41.66,20.62 24.38,20.62 22.73,22.28 22.73,33.07 19.56,36.25 U2.6
LPA: length 29.6
  Top Layer w0.508: U2.1 19.05,50.21 41.03,50.21 v3(41.15,50.09) ; v3(41.28,51.49) U7.3 45.48,51.49
  Bottom Layer w0.508: v3(41.28,51.49) 41.15,51.36 v3(41.15,50.09)
LPB: length 67.2
  Top Layer w0.508: v3(43,44.12) 43,44.12 U5.3 45.48,45.9 ; v3(43,19.48) 20.83,19.48 20.19,20.12 20.19,32.44 18.92,33.71 U2.7
  Bottom Layer w0.508: v3(43,19.48) v3(43,44.12)
LPWMA: length 25.8
  Top Layer w0.508: v3(29.72,51.74) R1.1
  Bottom Layer w0.508: 24.13,65.33 25.4,66.6 29.54,66.6 30.78,65.35 31.6,65.35 32.51,64.44 32.51,53.01 31.24,51.74 v3(29.72,51.74)
LPWMB: length 37.4
  Top Layer w0.508: v3(29.72,46.15) R6.1 ; 21.59,65.33 22.86,64.06 26.95,64.06 29.49,66.6 v3(32.89,66.6)
  Bottom Layer w0.508: v3(32.89,66.6) 33.53,65.96 33.53,48.31 31.37,46.15 v3(29.72,46.15)
PA2: length 7.7
  Bottom Layer w0.508: H1.12 25.4,86.92 29.54,86.92 30.78,85.67
PA3: length 7.7
  Top Layer w0.508: H1.11 22.86,84.38 26.95,84.38 28.25,85.67
PA4: length 7.7
  Bottom Layer w0.508: 24.13,83.11 25.4,84.38 29.54,84.38 30.78,83.13
PA5: length 7.7
  Top Layer w0.508: 28.25,83.13 26.95,81.84 22.86,81.84 21.59,83.11
PA9: length 92.2
  Top Layer w0.508: 71.26,70.43 68.56,70.43 67.56,71.42 v3(67.56,75.11)
  Bottom Layer w0.508: J2.3 57.28,14.53 61.47,14.53 63.5,16.56 63.5,73.46 65.15,75.11 v3(67.56,75.11) ; H2.23 76.58,71.68 72.5,71.68 71.26,70.43
PA10: length 90.7
  Top Layer w0.508: H2.24 79.07,69.14 75.09,69.14 73.8,70.43 72.55,71.68 69.22,71.68 68.58,72.31 v3(68.58,74.09)
  Bottom Layer w0.508: J3.3 57.15,11.23 61.34,11.23 64.39,14.28 64.39,72.95 65.53,74.09 v3(68.58,74.09)
PA11: length 82
  Bottom Layer w0.508: H2.21 76.58,74.22 72.5,74.22 71.26,72.97 66.19,72.97 65.15,71.93 65.15,13.13 61.09,9.07 58.17,9.07 J4#2.3
PA12: length 75
  Top Layer w0.508: v3(84.2,17.4) 92.83,17.4 CN7.5 ; 73.8,72.97 75.09,71.68 79.07,71.68 H2.22 81.66,71.68 v3(83.95,71.68)
  Bottom Layer w0.508: v3(84.2,17.4) 84.2,71.42 v3(83.95,71.68)
PB0: length 7.7
  Bottom Layer w0.508: H1.20 25.4,76.76 29.54,76.76 30.78,75.51
PB1: length 7.7
  Top Layer w0.508: H1.19 22.86,74.22 26.95,74.22 28.25,75.51
PB4: length 94.8
  Top Layer w0.508: CN7.4 92.83,15.39 v3(85.34,15.39) ; v3(81.53,86.92) v3(85.34,86.92)
  Bottom Layer w0.508: v3(81.53,86.92) 79.07,86.92 H2.11 76.58,86.92 72.5,86.92 71.26,85.67 ; v3(85.34,86.92) v3(85.34,15.39)
PB5: length 86.4
  Top Layer w0.508: 73.8,85.67 75.09,84.38 79.07,84.38 H2.12 80.38,85.69 86.09,85.69 v3(86.11,85.67) ; CN7.6 92.96,19.53 v3(86.11,19.53)
  Bottom Layer w0.508: v3(86.11,85.67) v3(86.11,19.53)
PB8: length 7.6
  Bottom Layer w0.508: 71.26,90.75 72.5,92 76.58,92 H2.7
PB9: length 7.6
  Top Layer w0.508: H2.8 79.07,89.46 75.09,89.46 73.8,90.75
PC4: length 7.7
  Bottom Layer w0.508: 24.13,78.03 25.4,79.3 29.54,79.3 30.78,78.05
PC5: length 8
  Top Layer w0.508: 21.59,78.03 21.84,78.03 23.11,76.76 27.2,76.76 U1.PC5
PC10: length 101.6
  Top Layer w0.508: 73.8,78.05 75.09,76.76 79.07,76.76 H2.18 80.39,78.03 v3(87.5,78.03)
  Bottom Layer w0.508: 66.55,8.18 72.14,8.18 73.66,9.7 CN11.4 74.11,10.15 78.49,14.53 86.57,14.53 87.5,15.46 v3(87.5,78.03)
PC11: length 111.9
  Top Layer w0.508: v3(81.53,81.84) v3(88.26,81.84)
  Bottom Layer w0.508: v3(81.53,81.84) 79.07,81.84 H2.15 76.58,81.84 72.5,81.84 71.26,80.59 ; 66.55,5.64 71.65,5.64 CN11.3 78.84,12.83 87.71,12.83 88.22,13.34 88.22,81.79 v3(88.26,81.84)
PC12: length 93.2
  Top Layer w0.508: 73.8,80.59 75.09,79.3 79.07,79.3 H2.16 80.39,80.57 v3(89.03,80.57)
  Bottom Layer w0.508: 81.53,10.02 81.97,10.47 87.5,10.47 89.03,11.99 v3(89.03,80.57)
PC13: length 7.7
  Top Layer w0.508: 28.25,98.37 26.95,97.08 22.86,97.08 21.59,98.35
PC14: length 16
  Top Layer w0.508: J4.3 13.46,95.81 21.59,95.81 22.86,94.54 26.95,94.54 28.25,95.83
PC15: length 7.7
  Bottom Layer w0.508: 24.13,95.81 25.4,97.08 29.54,97.08 30.78,95.83
PD2: length 103.8
  Top Layer w0.508: v3(81.53,84.38) v3(89.79,84.38)
  Bottom Layer w0.508: v3(81.53,84.38) 79.07,84.38 H2.13 76.58,84.38 72.5,84.38 71.26,83.13 ; 81.53,7.52 81.68,7.67 87.63,7.67 89.79,9.83 v3(89.79,84.38)
R2_1: length 2.5
  Top Layer w0.508: U7.4 45.48,54.03
R6_2: length 5.6
  Top Layer w0.508: R6.2 29,48.72 D2.1 33.42,48.72 U5.1
R8_1: length 2.5
  Top Layer w0.508: U5.4 45.48,48.44
R18_1: length 3.1
  Top Layer w0.508: 42.35,40.69 45.48,40.69
R19_1: length 3.1
  Top Layer w0.508: 42.35,35.61 45.48,35.61
R21_1: length 3.1
  Top Layer w0.508: 42.35,30.53 45.48,30.53
R23_1: length 3.1
  Top Layer w0.508: U8.10 45.48,25.45
RA1: length 28.5
  Top Layer w0.508: 73.8,83.13 75.09,81.84 79.07,81.84 H2.14 v3(84.58,83.13) ; v3(84.58,91.03) 93.34,91.03
  Bottom Layer w0.508: v3(84.58,83.13) v3(84.58,91.03)
RA2: length 36.1
  Top Layer w0.508: v3(82.3,76.56) 93.34,76.55
  Bottom Layer w0.508: 71.26,88.21 72.5,89.46 76.58,89.46 H2.9 79.07,89.46 81.53,89.46 82.3,88.7 v3(82.3,76.56)
RAIN1: length 88.9
  Top Layer w0.508: v3(71.37,30.18) R10.1 ; v3(66.68,70.41) 30.81,70.41 30.78,70.43
  Bottom Layer w0.508: v3(66.68,70.41) 66.68,31.95 68.45,30.18 v3(71.37,30.18) ; 30.78,70.43 29.54,71.68 25.4,71.68 H1.24
RAIN2: length 97.5
  Top Layer w0.508: H1.23 22.86,69.14 26.95,69.14 29.49,71.68 v3(65.91,71.68) ; v3(71.37,25.1) R5.1
  Bottom Layer w0.508: v3(65.91,71.68) 65.91,28.12 68.94,25.1 v3(71.37,25.1)
RAO1: length 41.4
  Top Layer w0.508: v3(92.07,45.26) U3.13 ; 93.34,81.03 93.34,81.03 v3(92.07,81.03)
  Bottom Layer w0.508: v3(92.07,81.03) v3(92.07,45.26)
RAO2: length 42.4
  Top Layer w0.508: v3(91.31,83.03) CN3.2 93.3,82.98 ; v3(91.31,47.8) U3.12
  Bottom Layer w0.508: v3(91.31,83.03) v3(91.31,47.8)
RB1: length 33.4
  Top Layer w0.508: v3(83.82,89.03) CN3.5 ; v3(81.53,79.3) v3(83.82,79.3)
  Bottom Layer w0.508: v3(81.53,79.3) 79.07,79.3 H2.17 76.58,79.3 72.5,79.3 71.26,78.05 ; v3(83.82,79.3) v3(83.82,89.03)
RB2: length 34.3
  Top Layer w0.508: 73.8,88.21 75.09,86.92 79.07,86.92 H2.10 v3(83.06,88.21) ; CN4.5 v3(83.06,74.55)
  Bottom Layer w0.508: v3(83.06,74.55) v3(83.06,88.21)
RBIN1: length 85
  Top Layer w0.508: R12.1 71.37,35.31 v3(71.35,35.33) ; v3(67.56,69.14) 29.49,69.14 26.95,66.6 22.86,66.6 H1.25
  Bottom Layer w0.508: v3(67.56,69.14) 67.56,38.02 70.26,35.33 v3(71.35,35.33)
RBIN2: length 76.1
  Top Layer w0.508: v3(71.32,40.41) 72.73,40.41 R14.1 ; 30.78,67.89 31.42,67.26 32.35,67.26 32.41,67.32 68.12,67.32 v3(68.43,67.01)
  Bottom Layer w0.508: 30.78,67.89 29.54,69.14 25.4,69.14 H1.26 ; v3(68.43,67.01) 68.43,41.43 69.44,40.41 v3(71.32,40.41)
RBO1: length 16
  Bottom Layer w0.508: U3.10 94.62,52.88 93.34,54.15 93.34,66.55
RBO2: length 26.8
  Top Layer w0.508: CN4.2 v3(90.55,68.55) ; v3(90.55,50.34) U3.11
  Bottom Layer w0.508: v3(90.55,68.55) v3(90.55,50.34)
RINA1: length 54.6
  Top Layer w0.381: 57.72,30.53 54.72,30.53
  Top Layer w0.508: v3(60.45,30.53) 57.72,30.53 ; v3(60.45,21.39) 77.22,21.39 78.74,22.91 78.74,40.31 U3.3
  Bottom Layer w0.508: v3(60.45,21.39) v3(60.45,30.53)
RINA2: length 49.1
  Top Layer w0.381: 54.72,25.45 U9.15 v3(59.69,25.45)
  Top Layer w0.508: U3.2 79.76,38.79 79.76,22.15 78.23,20.62 v3(59.69,20.62)
  Bottom Layer w0.508: v3(59.69,25.45) v3(59.69,20.62)
RINB1: length 35.3
  Top Layer w0.508: U3.5 75.56,42.22 v3(59.82,42.22) ; v3(59.82,35.61) 54.72,35.61
  Bottom Layer w0.508: v3(59.82,42.22) v3(59.82,35.61)
RINB2: length 31.1
  Top Layer w0.508: U3.6 73.79,42.98 58.93,42.98 57.72,41.77 57.72,40.69 54.72,40.69
RPA: length 71.3
  Top Layer w0.508: v3(61.34,19.86) 79.5,19.86 81.15,21.51 U3.1 ; v3(60.96,48.44) U10.3 R35.1
  Bottom Layer w0.508: v3(61.34,19.86) 61.34,48.06 v3(60.96,48.44)
RPB: length 40.3
  Top Layer w0.508: v3(59.56,43.74) 72.01,43.74 U3.7 ; v3(59.56,54.03) U11.3 R37.1
  Bottom Layer w0.508: v3(59.56,43.74) v3(59.56,54.03)
RPWMA: length 26.8
  Top Layer w0.508: R33.1 72.26,48.17 73.91,49.82 73.91,57.96 72.77,59.11 72.77,63.97 71.38,65.35 71.26,65.35
  Bottom Layer w0.508: H2.27 76.58,66.6 72.5,66.6 71.26,65.35
RPWMB: length 23.2
  Top Layer w0.508: 71.26,67.89 69.98,66.61 69.98,55.92 R36.1
  Bottom Layer w0.508: H2.25 76.58,69.14 72.5,69.14 71.26,67.89
SCL: length 85.8
  Top Layer w0.381: v3(16.89,72.95) 21.59,72.95
  Top Layer w0.508: 28.25,72.97 26.95,71.68 22.86,71.68 21.59,72.95 ; 13.59,2.59 13.59,7.04 14.1,7.54 v3(16.51,7.54)
  Bottom Layer w0.508: v3(16.89,72.95) 16.58,72.95 16.48,72.86 16.48,12.01 16.51,11.99 v3(16.51,7.54)
SDA: length 88.3
  Top Layer w0.508: v3(16.13,74.22) v3(20.7,74.22)
  Bottom Layer w0.508: 15.82,74.22 15.63,74.22 15.5,74.09 15.5,3.09 P1.4 ; v3(20.7,74.22) 22.86,74.22 24.13,72.95 25.4,74.22 29.54,74.22 30.78,72.97
SWCLK: length 7.4
  Top Layer w0.508: 80.37,75.51 79.02,74.17 75.4,74.17 U1.PA14
SWDIO: length 7.6
  Bottom Layer w0.508: 71.26,75.51 72.5,76.76 76.58,76.76 H2.19
U9_1: length 6.7
  Top Layer w0.508: 66.48,22.91 66.97,22.43 D7.1 72.06,22.43 R5.2
U9_3: length 6.7
  Top Layer w0.508: 66.48,27.99 66.89,27.58 72.17,27.58 R10.2
U9_5: length 6.6
  Top Layer w0.508: 72.74,33.31 72.19,32.76 D9.1 66.79,32.76 66.48,33.07
U9_7: length 6.6
  Top Layer w0.508: 66.48,38.15 66.76,37.87 72.22,37.87 72.74,38.39
U9_10: length 3
  Top Layer w0.508: 54.72,38.15 57.72,38.15
U9_12: length 3
  Top Layer w0.508: 54.72,33.07 57.72,33.07
U9_14: length 3
  Top Layer w0.381: 54.72,27.99 U9.14
U9_16: length 3.1
  Top Layer w0.381: 54.69,22.96 54.74,22.91 U9.16
U10_1: length 5.7
  Top Layer w0.508: 66.75,45.9 67.03,45.62 D11.1 71.59,45.62 R33.2
U10_4: length 2.5
  Top Layer w0.508: R34.1 U10.4
U11_1: length 5.7
  Top Layer w0.508: 66.75,51.49 67.03,51.21 D12.1 71.59,51.21 R36.2
U11_4: length 2.5
  Top Layer w0.508: R38.1 U11.4
VB: length 7.7
  Bottom Layer w0.508: 30.78,98.37 29.59,99.57 25.35,99.57 24.13,98.35

## Copper pours and planes (outline as drawn; the poured copper is in the pictures)
GND on Top Layer: -3.05,102.54 -2.67,102.92 101.22,102.92 106.3,97.84 106.3,-0.33 101.6,-5.03 3.56,-5.03 -3.43,1.96 -3.43,101.14
GND on Bottom Layer: -5.21,105.33 -5.08,105.46 103.76,105.46 110.87,98.35 110.87,-3.63 105.28,-9.22 3.43,-9.22 -6.22,0.43 -6.22,102.79
GGND on Top Layer: 49.4,55.3 49.4,52.76 46.48,52.76 46.48,49.96 49.4,49.96 49.4,47.17 46.48,47.17 46.48,44.63 49.4,44.63 49.4,39.42 46.48,39.42 46.48,36.88 49.4,36.88 49.4,34.34 46.48,34.34 46.48,31.8 49.4,31.8 49.4,29.26 46.48,29.26 46.48,26.72 49.4,26.72 49.4,24.18 46.48,24.18 46.48,18.85 48.77,18.85 48.77,21.64 50.8,21.64 50.8,24.18 53.72,24.18 53.72,26.72 50.8,26.72 50.8,29.26 53.72,29.26 53.72,31.8 50.8,31.8 50.8,34.34 53.72,34.34 53.72,36.88 50.8,36.88 50.8,39.42 53.72,39.42 53.72,41.96 50.8,41.96 50.8,47.17 53.97,47.17 53.97,49.96 50.8,49.96 50.8,52.76 53.97,52.76 53.97,55.3

Small or netless copper shapes (teardrops, artwork), in the pictures only: 389 on Top Layer, 177 on Bottom Layer

## Text on the board
Bottom Layer: JLCJLCJLCJLC
Top Silkscreen Layer: PC13 | PC14 | PC1 | PC3 | PA1 | PA3 | PA5 | PA7 | PC5 | PB1 | PB11 | PB13 | PB15 | PC7 | 3V3 | PC15 | PC0 | PC2 | PA0 | PA2 | PA4 | PA6 | PC4 | PB0 | PB10 | PB12 | PB14 | PC6 | GND | VB | BOT0 | PB8 | PB6 | PB4 | PD2 | PC11 | PA15 | PA13 | PA11 | PA9 | PC9 | PC8 | 5V | PB9 | PB7 | PB5 | PB3 | PC12 | PC10 | PA14 | PA12 | PA10 | BOT1 | RX | TX | 3.3V | 12V | VCC | M+ | M- | B | A | 7.4V | 步进 | 串口4 | 串口5
